# EAGLE board MicroBoardMk1 (EAGLE 7.2.0)
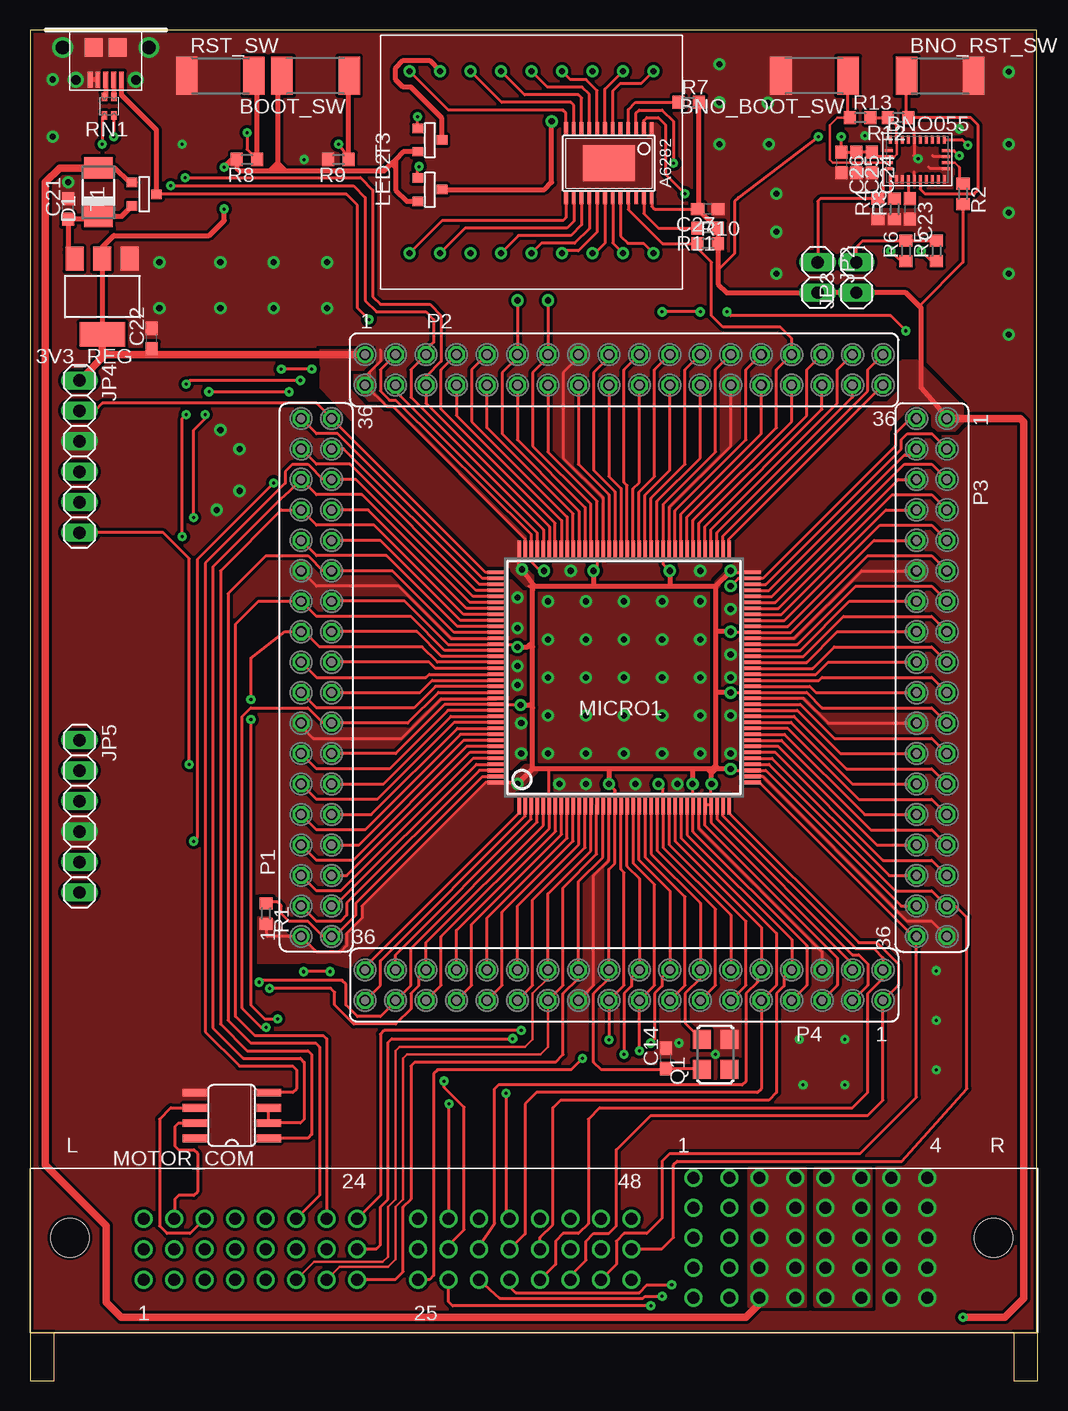
[diagram p4: board, top side]
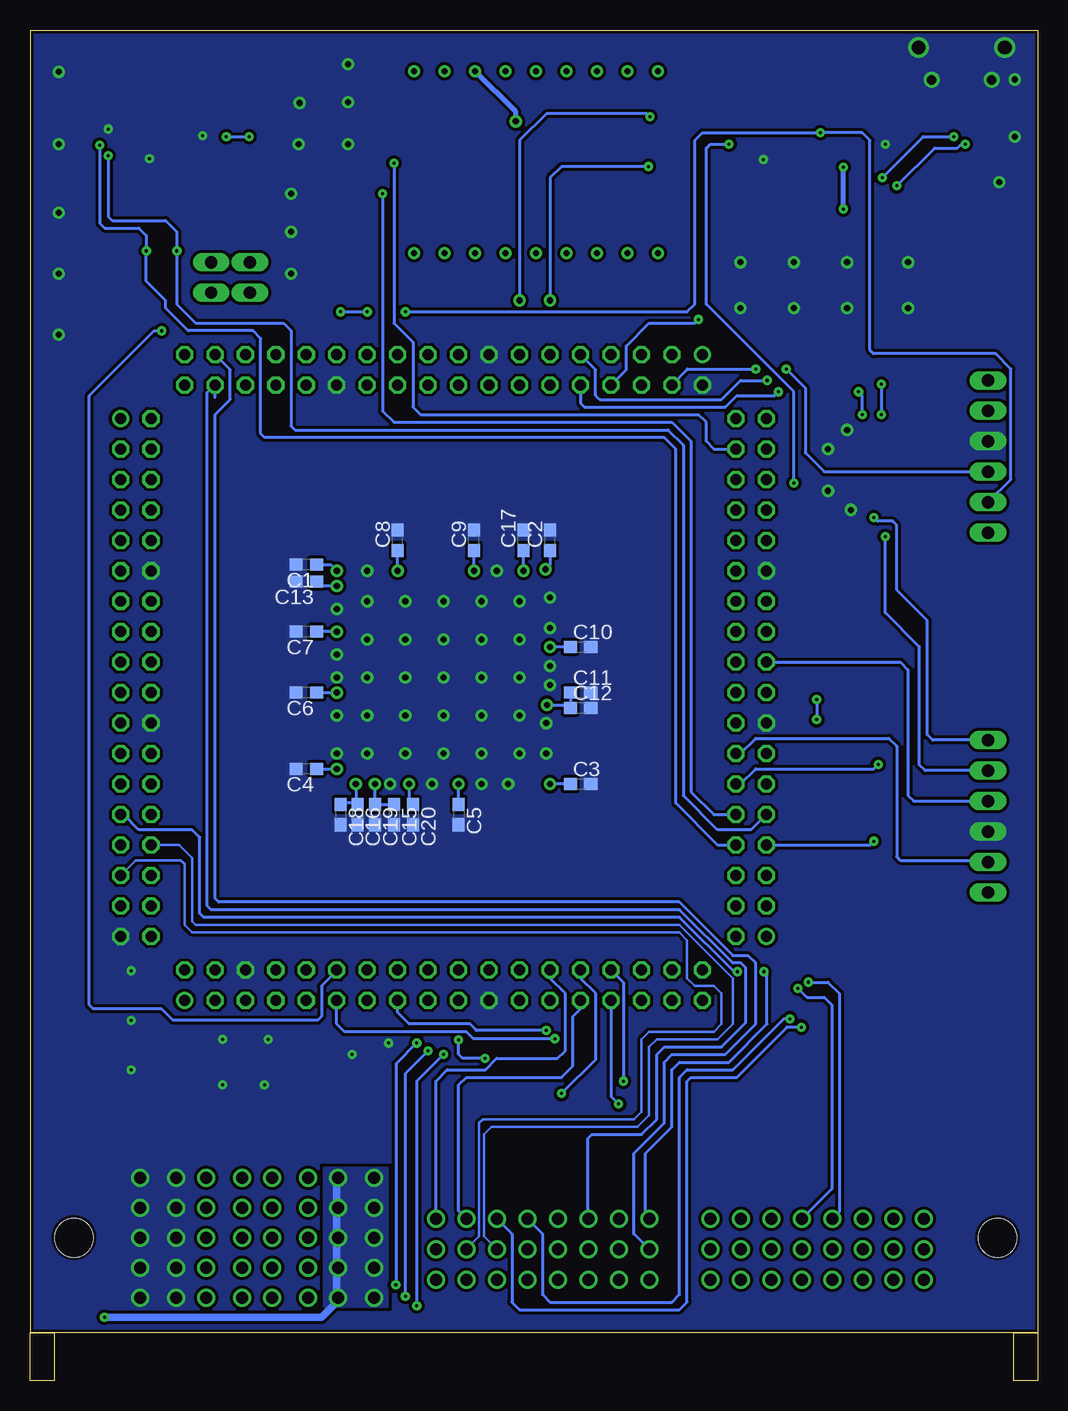
[diagram p5: board, bottom side, seen from below]

Size 83.95 x 108.58 mm. Coordinates in mm from the lower left corner, seen from the top.
Outline: 0,0 83.95,0 83.95,108.58 0,108.58 0,0
Copper layers (1*16): Top 0.035mm / dielectric 1.5mm / Bottom 0.035mm
Design rules "GoldPhoenix": minimum track width 7mil, minimum drill 10mil, track to track 7mil, track to pad 7mil, pad to pad 7mil, via to via 7mil, smd to smd 7mil, copper to edge 10mil, drill to drill 8mil, minimum pad ring 10mil, minimum via ring 10mil, stop-mask expansion 4mil, vias tented up to drill 25mil, thermal gap 10mil

## Footprints (pad centres in the part's own frame; a part is rotated, then mirrored left to right if it is on the bottom)
SOT223 = smd 1.499 x 2.007: 1 -2.261,-3.15; 2 0.025,-3.15; 3 2.311,-3.15 | smd 3.81 x 2.007: 4 0,3.15
TSSOP24 = smd 0.305 x 0.991: 1 -3.575,-2.918; 2 -2.925,-2.918; 3 -2.275,-2.918; 4 -1.625,-2.918; 5 -0.975,-2.918; 6 -0.325,-2.918; 7 0.325,-2.918; 8 0.975,-2.918; 9 1.625,-2.918; 10 2.275,-2.918; 11 2.925,-2.918; 12 3.575,-2.918; 13 3.575,2.918; 14 2.925,2.918; 15 2.275,2.918; 16 1.625,2.918; 17 0.975,2.918; 18 0.325,2.918; 19 -0.325,2.918; 20 -0.975,2.918; 21 -1.625,2.918; 22 -2.275,2.918; 23 -2.925,2.918; 24 -3.575,2.918 | smd 4.32 x 3: PAD 0,0
TEN60-S24-S24-P4-RA = drill 1: P1.1 55.32,12.9; P1.2 55.32,10.4; P1.3 55.32,7.9; P1.4 55.32,5.4; P1.5 55.32,2.9; P1.6 58.32,2.9; P1.7 58.32,5.4; P1.8 58.32,7.9; P1.9 58.32,10.4; P1.10 58.32,12.9; P2.1 60.82,12.9; P2.2 60.82,10.4; P2.3 60.82,7.9; P2.4 60.82,5.4; P2.5 60.82,2.9; P2.6 63.82,2.9; P2.7 63.82,5.4; P2.8 63.82,7.9; P2.9 63.82,10.4; P2.10 63.82,12.9; P3.1 66.32,12.9; P3.2 66.32,10.4; P3.3 66.32,7.9; P3.4 66.32,5.4; P3.5 66.32,2.9; P3.6 69.32,2.9; P3.7 69.32,5.4; P3.8 69.32,7.9; P3.9 69.32,10.4; P3.10 69.32,12.9; P4.1 71.82,12.9; P4.2 71.82,10.4; P4.3 71.82,7.9; P4.4 71.82,5.4; P4.5 71.82,2.9; P4.6 74.82,2.9; P4.7 74.82,5.4; P4.8 74.82,7.9; P4.9 74.82,10.4; P4.10 74.82,12.9; S1 9.49,4.4; S2 12.03,4.4; S3 14.57,4.4; S4 17.11,4.4; S5 19.65,4.4; S6 22.19,4.4; S7 24.73,4.4; S8 27.27,4.4; S9 9.49,6.94; S10 12.03,6.94; S11 14.57,6.94; S12 17.11,6.94; S13 19.65,6.94; S14 22.19,6.94; S15 24.73,6.94; S16 27.27,6.94; S17 9.49,9.48; S18 12.03,9.48; S19 14.57,9.48; S20 17.11,9.48; S21 19.65,9.48; S22 22.19,9.48; S23 24.73,9.48; S24 27.27,9.48; S25 32.37,4.4; S26 34.91,4.4; S27 37.45,4.4; S28 39.99,4.4; S29 42.53,4.4; S30 45.07,4.4; S31 47.61,4.4; S32 50.15,4.4; S33 32.37,6.94; S34 34.91,6.94; S35 37.45,6.94; S36 39.99,6.94; S37 42.53,6.94; S38 45.07,6.94; S39 47.61,6.94; S40 50.15,6.94; S41 32.37,9.48; S42 34.91,9.48; S43 37.45,9.48; S44 39.99,9.48; S45 42.53,9.48; S46 45.07,9.48; S47 47.61,9.48; S48 50.15,9.48 | hole 3.2: 3.32,7.9; 80.32,7.9
LGA28 = smd 0.25 x 0.675: P$1 -2.25,1.663; P$6 -2.25,-1.663; P$7 -1.75,-1.663; P$8 -1.25,-1.663; P$9 -0.75,-1.663; P$10 -0.25,-1.663; P$11 0.25,-1.663; P$12 0.75,-1.663; P$13 1.25,-1.663; P$14 1.75,-1.663; P$15 2.25,-1.663; P$20 2.25,1.663; P$21 1.75,1.663; P$22 1.25,1.663; P$23 0.75,1.663; P$24 0.25,1.663; P$25 -0.25,1.663; P$26 -0.75,1.663; P$27 -1.25,1.663; P$28 -1.75,1.663 | smd 0.675 x 0.25: P$2 -2.362,0.75; P$3 -2.362,0.25; P$4 -2.362,-0.25; P$5 -2.362,-0.75; P$16 2.362,-0.75; P$17 2.362,-0.25; P$18 2.362,0.25; P$19 2.362,0.75
SW_2512 = smd 1.8 x 3.2: 1 -2.8,0; 2 2.8,0
C0603 = smd 1.1 x 1: 1 -0.85,0; 2 0.85,0
DO-214AC = smd 1.8 x 2.4: A 2.025,0; C -2.025,0
MICRO_B = smd 1.5 x 1.55: GND1 -1,1.45; GND2 1,1.45 | drill 0.8: GND3 -2.5,4.15; GND4 2.5,4.15 | drill 1.15: GND7 -3.598,1.45; GND8 3.598,1.45 | smd 0.4 x 1.35: P1 -1.3,4.15; P2 -0.65,4.15; P3 0,4.15; P4 0.65,4.15; P5 1.3,4.15
1X02 = drill 1.016 long: 1 -1.27,0; 2 1.27,0
1X06 = drill 1.016 long: 1 -6.35,0; 2 -3.81,0; 3 -1.27,0; 4 1.27,0; 5 3.81,0; 6 6.35,0
SOT-23 = smd 0.787 x 0.889: 1 0.025,-1.016; 2 -0.94,1.016; 3 0.991,1.016
SQFP-S-20X20-144 = smd 0.3 x 1.6: 1 -8.75,-10.6; 2 -8.25,-10.6; 3 -7.75,-10.6; 4 -7.25,-10.6; 5 -6.75,-10.6; 6 -6.25,-10.6; 7 -5.75,-10.6; 8 -5.25,-10.6; 9 -4.75,-10.6; 10 -4.25,-10.6; 11 -3.75,-10.6; 12 -3.25,-10.6; 13 -2.75,-10.6; 14 -2.25,-10.6; 15 -1.75,-10.6; 16 -1.25,-10.6; 17 -0.75,-10.6; 18 -0.25,-10.6; 19 0.25,-10.6; 20 0.75,-10.6; 21 1.25,-10.6; 22 1.75,-10.6; 23 2.25,-10.6; 24 2.75,-10.6; 25 3.25,-10.6; 26 3.75,-10.6; 27 4.25,-10.6; 28 4.75,-10.6; 29 5.25,-10.6; 30 5.75,-10.6; 31 6.25,-10.6; 32 6.75,-10.6; 33 7.25,-10.6; 34 7.75,-10.6; 35 8.25,-10.6; 36 8.75,-10.6; 73 8.75,10.6; 74 8.25,10.6; 75 7.75,10.6; 76 7.25,10.6; 77 6.75,10.6; 78 6.25,10.6; 79 5.75,10.6; 80 5.25,10.6; 81 4.75,10.6; 82 4.25,10.6; 83 3.75,10.6; 84 3.25,10.6; 85 2.75,10.6; 86 2.25,10.6; 87 1.75,10.6; 88 1.25,10.6; 89 0.75,10.6; 90 0.25,10.6; 91 -0.25,10.6; 92 -0.75,10.6; 93 -1.25,10.6; 94 -1.75,10.6; 95 -2.25,10.6; 96 -2.75,10.6; 97 -3.25,10.6; 98 -3.75,10.6; 99 -4.25,10.6; 100 -4.75,10.6; 101 -5.25,10.6; 102 -5.75,10.6; 103 -6.25,10.6; 104 -6.75,10.6; 105 -7.25,10.6; 106 -7.75,10.6; 107 -8.25,10.6; 108 -8.75,10.6 | smd 1.6 x 0.3: 37 10.6,-8.75; 38 10.6,-8.25; 39 10.6,-7.75; 40 10.6,-7.25; 41 10.6,-6.75; 42 10.6,-6.25; 43 10.6,-5.75; 44 10.6,-5.25; 45 10.6,-4.75; 46 10.6,-4.25; 47 10.6,-3.75; 48 10.6,-3.25; 49 10.6,-2.75; 50 10.6,-2.25; 51 10.6,-1.75; 52 10.6,-1.25; 53 10.6,-0.75; 54 10.6,-0.25; 55 10.6,0.25; 56 10.6,0.75; 57 10.6,1.25; 58 10.6,1.75; 59 10.6,2.25; 60 10.6,2.75; 61 10.6,3.25; 62 10.6,3.75; 63 10.6,4.25; 64 10.6,4.75; 65 10.6,5.25; 66 10.6,5.75; 67 10.6,6.25; 68 10.6,6.75; 69 10.6,7.25; 70 10.6,7.75; 71 10.6,8.25; 72 10.6,8.75; 109 -10.6,8.75; 110 -10.6,8.25; 111 -10.6,7.75; 112 -10.6,7.25; 113 -10.6,6.75; 114 -10.6,6.25; 115 -10.6,5.75; 116 -10.6,5.25; 117 -10.6,4.75; 118 -10.6,4.25; 119 -10.6,3.75; 120 -10.6,3.25; 121 -10.6,2.75; 122 -10.6,2.25; 123 -10.6,1.75; 124 -10.6,1.25; 125 -10.6,0.75; 126 -10.6,0.25; 127 -10.6,-0.25; 128 -10.6,-0.75; 129 -10.6,-1.25; 130 -10.6,-1.75; 131 -10.6,-2.25; 132 -10.6,-2.75; 133 -10.6,-3.25; 134 -10.6,-3.75; 135 -10.6,-4.25; 136 -10.6,-4.75; 137 -10.6,-5.25; 138 -10.6,-5.75; 139 -10.6,-6.25; 140 -10.6,-6.75; 141 -10.6,-7.25; 142 -10.6,-7.75; 143 -10.6,-8.25; 144 -10.6,-8.75
SO08 = smd 0.66 x 2.032: 1 -1.905,-3.073; 2 -0.635,-3.073; 3 0.635,-3.073; 4 1.905,-3.073; 5 1.905,3.073; 6 0.635,3.073; 7 -0.635,3.073; 8 -1.905,3.073
FE18-2 = drill 0.914: 1 -21.59,1.27 | drill 0.914 octagon: 2 -21.59,-1.27; 3 -19.05,1.27; 4 -19.05,-1.27; 5 -16.51,1.27; 6 -16.51,-1.27; 7 -13.97,1.27; 8 -13.97,-1.27; 9 -11.43,1.27; 10 -11.43,-1.27; 11 -8.89,1.27; 12 -8.89,-1.27; 13 -6.35,1.27; 14 -6.35,-1.27; 15 -3.81,1.27; 16 -3.81,-1.27; 17 -1.27,1.27; 18 -1.27,-1.27; 19 1.27,1.27; 20 1.27,-1.27; 21 3.81,1.27; 22 3.81,-1.27; 23 6.35,1.27; 24 6.35,-1.27; 25 8.89,1.27; 26 8.89,-1.27; 27 11.43,1.27; 28 11.43,-1.27; 29 13.97,1.27; 30 13.97,-1.27; 31 16.51,1.27; 32 16.51,-1.27; 33 19.05,1.27; 34 19.05,-1.27; 35 21.59,1.27; 36 21.59,-1.27
ASF = smd 1.6 x 1.5: 1 -1.25,-1.15; 2 1.25,-1.15; 3 1.25,1.15; 4 -1.25,1.15
R0603 = smd 1 x 1.1: 1 -0.85,0; 2 0.85,0
EXBV4V = smd 0.45 x 0.7: 1 -0.4,-0.775; 2 0.4,-0.775; 3 0.4,0.775; 4 -0.4,0.775
LEDDISP = drill 0.5: P$1 2.44,2.995; P$2 4.98,2.995; P$3 7.52,2.995; P$4 10.06,2.995; P$5 12.6,2.995; P$6 15.14,2.995; P$7 17.68,2.995; P$8 20.22,2.995; P$9 22.76,2.995; P$10 2.44,18.155; P$11 4.98,18.155; P$12 7.52,18.155; P$13 10.06,18.155; P$14 12.6,18.155; P$15 15.14,18.155; P$16 17.68,18.155; P$17 20.22,18.155; P$18 22.76,18.155

## Placement (x,y rotation side)
3V3_REG  AP1117-3.3SOT223  [SOT223]  6.03,86.36 180 top
A6282  A6282  [TSSOP24]  48.26,97.47 180 top
BACKPLANECON_  TEN60-S24-S24-P4-RA  [TEN60-S24-S24-P4-RA]  0,0 0 top
BNO055  BNO055  [LGA28]  73.98,97.79 0 top
BNO_BOOT_SW  SWITCH  [SW_2512]  65.41,104.78 180 top
BNO_RST_SW  SWITCH  [SW_2512]  75.88,104.78 0 top
BOOT_SW  SWITCH  [SW_2512]  23.81,104.78 180 top
C1  0.1uF  [C0603]  60.96,64.01 180 bottom
C2  0.1uF  [C0603]  40.64,66.04 90 bottom
C3  0.1uF  [C0603]  38.1,45.72 0 bottom
C4  0.1uF  [C0603]  60.96,46.99 180 bottom
C5  0.1uF  [C0603]  48.26,43.18 270 bottom
C6  0.1uF  [C0603]  60.96,53.34 180 bottom
C7  0.1uF  [C0603]  60.96,58.42 180 bottom
C8  0.1uF  [C0603]  53.34,66.04 90 bottom
C9  0.1uF  [C0603]  46.99,66.04 90 bottom
C10  0.1uF  [C0603]  38.1,57.15 0 bottom
C11  0.1uF  [C0603]  38.1,53.34 0 bottom
C12  4.7uF  [C0603]  38.1,52.07 0 bottom
C13  2.2uF  [C0603]  60.96,62.61 180 bottom
C14  0.01uF  [C0603]  53.02,22.86 90 top
C15  1uF  [C0603]  53.66,43.18 270 bottom
C16  10nF  [C0603]  56.71,43.18 270 bottom
C17  2.2uF  [C0603]  42.86,66.04 90 bottom
C18  1uF  [C0603]  58.1,43.18 270 bottom
C19  10nF  [C0603]  55.24,43.18 270 bottom
C20  0.1uF  [C0603]  52.07,43.18 270 bottom
C21  0.22uF  [C0603]  3.17,93.66 90 top
C22  0.22uF  [C0603]  10.16,82.87 90 top
C23  0.1uF  [C0603]  73.34,93.66 270 top
C24  0.1uF  [C0603]  70.17,97.55 270 top
C25  6.8nF  [C0603]  68.9,97.55 270 top
C26  120nF  [C0603]  67.63,97.55 270 top
C27  0.1uF  [C0603]  56.52,93.66 180 top
D1  S1M-E3/61T  [DO-214AC]  5.71,95.06 90 top
JP1  MICROUSB  [MICRO_B]  6.32,108.58 180 top
JP2  [1X02]  65.67,87.95 270 top
JP3  [1X02]  68.9,87.95 90 top
JP4  [1X06]  4.13,73.03 270 top
JP5  [1X06]  4.13,43.03 270 top
LED2  FDN340P  [SOT-23]  33.34,95.25 90 top
MICRO1  [SQFP-S-20X20-144]  49.53,54.61 0 top
MOTOR_COM  MAX481CSA  [SO08]  16.83,18.1 90 top
P1  [FE18-2]  23.88,54.61 90 top
P2  [FE18-2]  49.53,80.26 0 top
P3  [FE18-2]  75.18,54.61 270 top
P4  [FE18-2]  49.53,28.96 180 top
Q1  ASV-8  [ASF]  57.15,23.18 90 top
R1  0 Ohm  [R0603]  19.68,34.92 270 top
R2  4.7K  [R0603]  77.79,94.93 270 top
R3  4.7K  [R0603]  72.07,93.66 90 top
R4  4.7K  [R0603]  70.68,93.66 90 top
R5  4.7K  [R0603]  75.56,90.17 90 top
R6  4.7K  [R0603]  73.03,90.17 90 top
R7  10K  [R0603]  54.93,102.55 0 top
R8  10K  [R0603]  18.1,97.79 180 top
R9  [R0603]  25.72,97.79 180 top
R10  [R0603]  56.52,90.78 0 top
R11  820  [R0603]  56.52,92.08 180 top
R12  4.7K  [R0603]  72.39,101.28 180 top
R13  4.7K  [R0603]  69.22,101.28 0 top
RN1  [EXBV4V]  6.6,102.23 180 top
RST_SW  SWITCH  [SW_2512]  15.88,104.78 0 top
T1  FDN340P  [SOT-23]  9.53,94.87 90 top
T3  FDN340P  [SOT-23]  33.34,99.38 90 top
U$3  LEDDISP  [LEDDISP]  29.21,87 0 top

## Tracks (layer width: path | path; a pad name or v marks a point on that pad's centre or on a via)
!OE_LED
  Top 0.254: A6282.21 49.88,93.62 52.73,90.78 R10.1 55.66,90.39 56.83,89.22 56.83,84.77 57.78,83.82 62.55,83.82 63.5,82.87 P2.29 62.23,80.26 62.23,75.44 54.78,67.99 MICRO1.80
+3V3  (via drill 0.25, 0.51)
  Top 0.203: BNO055.P$3 72.07,98.04 72.25,98.22 72.25,99.35 72.25,99.43 BNO055.P$28 72.23,100.59 R12.2
  Top 0.254: P2.25 57.15,80.26 57.15,73.41 52.78,69.04 MICRO1.84 52.78,64.06 v53.34,63.5 | P2.14 43.18,73.41 47.28,69.31 MICRO1.95 47.28,63.79 v46.99,63.5 | P1.24 31.24,60.96 34.84,57.36 MICRO1.121 40.43,57.36 v40.64,57.15 | P1.14 30.48,48.26 34.58,52.36 MICRO1.131 40.86,52.36 v40.89,52.32 | P4.31 34.29,28.96 34.29,33.02 43.31,42.04 43.31,43.98 MICRO1.6 43.28,46.89 43.18,46.99 | P4.7 64.77,28.96 64.77,32.26 55.28,41.75 MICRO1.30 55.24,44.05 v55.24,45.72 | P4.5 67.31,28.96 67.31,31.24 56.28,42.27 MICRO1.32 MICRO1.33 | MICRO1.33 56.78,42.53 68.58,30.73 P4.4 | P3.34 72.64,35.56 61.34,46.86 MICRO1.39 58.55,46.86 v58.42,46.99 | P3.21 75.18,52.07 66.04,52.07 64.75,53.36 MICRO1.52 C6.1 v58.42,53.34 | P3.11 75.18,64.77 69.85,64.77 63.44,58.36 MICRO1.62 58.48,58.36 v58.42,58.42 | 55.24,46.86 55.37,46.99 | 57.15,53.34 57.17,53.36 57.19,53.34 | 41.66,52.32 41.91,52.07 | 41.7,57.36 41.91,57.15 | v40.64,45.72 40.5,45.86 MICRO1.144 | MICRO1.144 37.99,45.86 27.69,35.56 27.69,34.54 26.42,33.27 26.42,32.26 25.91,31.75 23.88,31.75 P1.1 19.79,33.02 R1.2 | MICRO1.144 40.78,45.86 | v41.02,63.63 40.77,63.88 40.77,65.2 MICRO1.108 | v58.42,63.5 58.56,63.36 MICRO1.72 | MICRO1.33 56.78,45.67 v56.83,45.72 | 56.83,46.93 56.77,46.99 | 41.91,61.91 41.59,62.23 | 42.23,62.23 41.91,62.55 | MICRO1.17 48.78,45.2 v48.26,45.72 48.77,45.21 48.77,39.12 48.26,38.61 P4.20 48.26,29.53 46.99,28.26 46.99,22.54 47.62,21.91 52.92,21.91 C14.1 55.92,22.01 Q1.4 | A6282.24 51.84,93.9 52.07,93.66 C27.2 55.78,93.78 | R11.1 R10.2 | R13.2 R12.2 | R2.2 77.79,89.22 74.14,85.57 | BNO055.P$3 70.45,98.04 C24.1 C25.1 C26.1 v67.63,99.69
  Top 0.254: v65.72,99.69 59.05,94.61 58.74,94.3 58.74,89.95 57.37,88.58
  Top 0.406: 57.15,46.99 56.9,46.99 | 56.52,46.99 56.77,46.99 56.9,46.99 | 56.52,46.99 55.37,46.99 55.24,46.99 | 55.24,46.99 48.26,46.99 | 48.26,46.99 43.18,46.99 41.91,46.99 | 41.91,46.99 41.91,52.07 41.91,57.15 41.91,61.91 41.91,62.23 | 41.91,62.23 42.23,62.23 46.99,62.23 | 46.99,62.23 53.34,62.23 | 53.34,62.23 57.15,62.23 | 57.15,62.23 57.15,58.42 | 57.15,58.42 57.15,53.34 57.15,47.24 | 57.15,47.24 57.15,46.99 | v40.89,52.32 41.66,52.32 | v40.64,57.15 41.49,57.15 41.7,57.36 | v46.99,63.5 46.99,62.23 | v53.34,63.5 53.34,62.23 | v58.42,58.42 57.15,58.42 | v58.42,53.34 57.19,53.34 | 48.26,46.99 v48.26,45.72 | v58.42,46.99 57.4,46.99 | 57.4,46.99 57.15,46.99 | 40.78,45.86 41.91,46.99 | 41.91,62.23 41.91,62.42 v41.02,63.63 | 57.15,62.23 v58.42,63.5 | v56.83,45.72 56.83,46.93 | 55.24,46.99 v55.24,45.72 | 56.52,46.99 56.77,46.74 56.9,46.74 57.15,46.99 | 57.4,46.99 57.15,47.24 | 56.9,46.99 57.15,47.24 | BOOT_SW.2 20.64,104.4 20.64,97.47 | v16.19,93.66 16.19,92.71 14.92,91.44 6.99,91.44 6.01,90.46 3V3_REG.2 6.01,83.24 3V3_REG.4 | 31.11,98.42 32.32,98.49 T3.2 31.13,98.44 31.11,98.42 | 31.11,98.42 30.48,97.79 | 30.48,97.79 30.48,97.16 | 30.48,97.16 30.48,95.25 31.43,94.3 32.31,94.3 LED2.2 | 76.52,76.2 74.3,78.74 74.3,85.41 74.14,85.57 73.03,86.68 JP3.1 JP2.2 58.1,86.68 57.37,87.42 57.37,88.58 R11.1 57.15,92.08 57.15,92.18 C27.2 | 55.78,93.78 R7.2 | 20,96.84 17.46,96.84 17.25,97.05 R8.2 16.83,97.79 v16.19,97.16 | 20,96.84 20.64,96.84 | 20.64,96.84 21.27,96.84 | 21.27,96.84 29.53,96.84 30.16,97.47 | 20.64,97.47 20.64,96.84 | 20,96.84 20.64,97.47 | 20.64,97.47 21.27,96.84 | 30.16,97.47 30.48,97.79 | 30.16,97.47 30.48,97.16
  Top 0.61: v77.79,1.27 81.28,1.27 82.87,2.86 82.87,75.88 82.55,76.2 76.52,76.2 P3.1 | P2.1 9.84,81.53 | 9.84,81.53 6.41,81.53 6.35,81.6 | JP4.1 6.35,81.6 | 6.35,81.6 6.03,81.92 3V3_REG.4 | C22.1 9.84,81.7 9.84,81.53
  Bottom 0.254: 40.6,52.32 v40.89,52.32 39.2,52.32 C12.1 C11.1 | C10.1 v40.64,57.15 | v46.99,63.5 C9.1 | v53.34,63.5 C8.1 | v58.42,58.42 C7.1 | C6.1 v58.42,53.34 | C4.1 v58.42,46.99 | C3.1 v40.64,45.72 | C2.1 40.64,64.01 v41.02,63.63 | C1.1 58.93,64.01 v58.42,63.5 | C15.1 C19.1 v55.24,45.72 | v56.83,45.72 56.83,44.16 | 56.83,44.16 C16.1 | 56.83,44.16 57.98,44.16 C18.1 | C5.1 v48.26,45.72 | v67.63,99.69 v65.72,99.69 | P1.14 24.77,48.26 23.5,49.53 12.38,49.53 11.75,48.9 11.75,39.69 11.43,39.37 4.29,39.37 JP5.5
  Bottom 0.406: v16.19,93.66 v16.19,97.16
  Bottom 0.61: BACKPLANECON_.P1.10 58.42,12.8 58.42,2.54 59.69,1.27 v77.79,1.27
  pour Top (isolate 0.305, no thermals): 41.91,62.23 41.4,62.23 39.62,64.01 39.37,63.75 38.35,63.75 26.92,75.18 26.92,75.95 24.26,78.74 24.26,81.92 28.45,81.92 28.45,80.26 26.54,80.26 26.54,78.74 27.94,77.22 28.96,77.22 29.46,76.71 29.97,76.71 40.77,65.91 40.77,64.26 41.91,63.12
  pour Bottom (isolate 0.305, no thermals): 59.37,2.22 59.37,13.65 54.61,13.65 54.29,13.65 54.29,2.22
  pour Top (isolate 0.305, no thermals): 57.15,61.91 58.74,63.5 60.96,63.5 71.75,74.3 71.75,75.56 73.34,77.15 74.61,77.15 75.25,76.52 75.25,75.56 75.56,75.25 77.15,75.25 77.79,75.88 77.79,77.15 73.98,80.96 72.71,80.96 72.39,80.64 72.39,78.42 71.44,77.47 70.17,77.47 58.74,66.04 58.74,64.14 57.15,62.55
  pour Top (isolate 0.305, no thermals): 41.27,47.31 41.91,47.31 42.23,46.99 42.23,46.67 40.32,44.77 40.32,43.5 28.26,31.43 27.62,31.43 26.67,30.48 26.35,30.48 25.08,30.8 19.05,30.8 19.05,34.61 20,34.61 21.59,33.02 22.54,33.02 23.81,31.75 25.72,31.75 26.35,32.38 26.35,33.34 27.62,34.61 27.62,35.56 37.78,45.72 40.01,45.72 40.32,46.04 40.32,46.35
+5V
  Top 0.406: T1.3 8.8,95.89 8.26,95.89 7.06,97.08 D1.A
  Top 0.61: BACKPLANECON_.P2.5 60.82,2.4 59.69,1.27 7.62,1.27 6.35,2.54 6.35,8.89 1.27,13.97 1.27,95.89 2.47,97.08 D1.A 6.1,97.16
  pour Top (isolate 0.305, no thermals): 60.01,2.22 60.01,13.65 64.58,13.65 64.58,2.22
+12V
  pour Top (isolate 0.305, no thermals): 65.53,2.22 65.53,13.65 70.04,13.65 70.04,2.22
BILGEPWM  (via drill 0.25)
  Top 0.254: P3.27 75.18,44.45 69.09,44.45 63.18,50.36 MICRO1.46 | v25.01,30.09 v22.81,30.09
  Bottom 0.254: BACKPLANECON_.S41 32.7,9.81 32.7,14.92 30.48,17.14 30.48,21.91 29.84,22.54 25.72,22.54 22.54,25.72 22.54,29.82 v22.81,30.09 | P3.27 76.2,43.18 74.93,41.91 70.48,41.91 69.85,41.27 69.85,34.92 69.53,34.61 29.84,34.61 25.32,30.09 v25.01,30.09
BNO055_SCL  (via drill 0.25)
  Top 0.254: MICRO1.136 35.89,49.86 27.94,41.91 23.88,41.91 P1.9 | BNO055.P$19 77.04,98.54 v77.47,98.11 | 71.75,90.27 v71.75,90.17 72.39,89.53 72.81,89.53 R6.1
  Bottom 0.254: v77.47,98.11 77.47,93.03 77.15,92.71 72.71,92.71 71.75,91.76 v71.75,90.17 71.75,85.72 70.17,84.14 62.87,84.14 62.23,83.5 62.23,75.56 61.91,75.25 30.8,75.25 29.53,73.98 29.53,44.77 26.67,41.91 23.88,41.91 P1.9
BNO055_SDA  (via drill 0.25)
  Top 0.254: P1.8 27.43,40.64 36.15,49.36 MICRO1.137 | BNO055.P$20 77.71,99.45 v78.18,98.98 | v74.3,90.17 74.93,89.53 75.35,89.53 R5.1
  Bottom 0.254: P1.8 26.67,40.64 30.16,44.13 30.16,73.66 31.11,74.61 64.45,74.61 64.77,74.93 64.77,82.87 65.41,83.5 70.8,83.5 72.71,85.41 72.71,86.04 74.3,87.63 v74.3,90.17 74.3,91.44 74.93,92.08 77.79,92.08 78.18,92.47 v78.18,98.98
BOOT0  (via drill 0.25)
  Top 0.254: MICRO1.138 36.41,48.86 26.92,39.37 23.88,39.37 P1.7 | v13.65,40.96 13.97,41.27 13.97,64.48 v20.32,70.83 | 26.57,97.89 v25.72,99.06
  Top 0.406: 26.67,104.72 BOOT_SW.1 26.57,104.73 26.57,97.89 R9.1
  Bottom 0.254: P1.7 13.97,40.64 v13.65,40.96 | v20.32,70.83 20.32,78.42 27.62,85.72 27.62,98.74 27.3,99.06 v25.72,99.06
CLAWCURRENT
  Top 0.254: MICRO1.40 61.61,47.36 72.14,36.83 75.18,36.83 P3.33 77.15,35.56 78.11,34.61 78.11,20.32 72.71,14.29 53.98,14.29 53.66,13.97 53.66,7.94 52.7,6.99 50.2,6.99 BACKPLANECON_.S40
CLAWPWM1  (via drill 0.25)
  Top 0.254: MICRO1.19 49.78,38.87 50.8,37.85 P4.18 50.16,29.59 50.16,28.89 49.53,28.26 v49.53,23.18 | v51.75,2.22 35.24,2.22 34.91,2.56 BACKPLANECON_.S26
  Bottom 0.254: v51.75,2.22 51.75,20.95 v49.53,23.18
CLAWPWM2  (via drill 0.25)
  Top 0.254: v48.26,24.4 P4.19 49.53,28.96 49.53,38.35 49.28,38.61 MICRO1.18 | BACKPLANECON_.S25 33.29,4.4 33.66,4.76 33.66,21.59 33.97,21.91 45.11,21.91 v46.06,22.86
  Bottom 0.254: v46.06,22.86 47.94,22.86 48.26,23.18 v48.26,24.4
D+1
  Top 0.406: JP1.P3 6.32,103.13 RN1.2
D-1
  Top 0.406: RN1.1 7,104.4 JP1.P2
FUSEDETECTM  (via drill 0.25)
  Top 0.254: P4.15 54.61,28.96 54.61,36.32 51.31,39.62 51.31,43.98 MICRO1.22 | BACKPLANECON_.S24 29.21,11.42 29.21,24.87 29.53,25.18 v40.96,25.18
  Bottom 0.254: P4.15 53.34,26.67 52.39,25.72 47.31,25.72 46.77,25.18 v40.96,25.18
FUSEDETECTP  (via drill 0.25)
  Top 0.254: P4.11 59.69,28.96 59.69,34.29 53.28,40.7 MICRO1.26 | BACKPLANECON_.S16 27.32,6.99 28.89,6.99 29.21,7.3 29.21,10.48 29.84,11.11 29.84,24.18 30.16,24.5 v40.25,24.5
  Bottom 0.254: P4.11 58.42,25.72 57.78,25.08 47.62,25.08 47.04,24.5 v40.25,24.5
GND  (via drill 0.25, 0.51)
  Top 0.254: P2.26 58.42,73.91 53.28,68.77 MICRO1.83 | P2.2 29.72,77.22 30.23,77.22 41.27,66.17 MICRO1.107 | P2.15 45.72,81.28 44.45,80.01 44.45,72.9 47.75,69.6 47.75,65.24 MICRO1.94 | P1.25 23.88,62.23 30.73,62.23 35.1,57.86 MICRO1.120 | P1.15 22.61,50.55 23.62,49.53 30.99,49.53 34.29,52.83 38.9,52.83 MICRO1.130 | P4.21 46.99,28.96 46.99,38.1 48.26,39.37 48.26,43.99 MICRO1.16 | P4.6 66.04,31.75 55.78,42.01 MICRO1.31 | P3.35 75.18,34.29 73.15,34.29 61.09,46.35 MICRO1.38 | P3.22 66.55,50.8 64.49,52.86 MICRO1.51 | P3.12 69.34,63.5 63.7,57.86 MICRO1.61 | BNO055.P$10 73.73,96.77 | BNO055.P$18 75.31,98.04 75.25,98.11 | BNO055.P$16 75.05,97.04 74.93,97.16 | BNO055.P$25 73.73,98.17 73.66,98.11 | 73.74,99.31 73.74,100.05 | 29.21,81.92 29.21,80.96 28.26,80.01 28.26,79.38 27.94,79.06
  Top 0.406: JP1.P4 JP1.P5
  other vias: 40.64,61.28 40.64,58.74 40.64,55.56 40.64,53.98 40.96,50.8 40.96,48.26 43.18,60.96 43.18,57.78 43.18,54.61 43.18,51.44 43.18,48.26 46.35,48.26 46.35,51.44 46.35,54.61 46.35,57.78 46.35,60.96 49.53,60.96 49.53,57.78 49.53,54.61 49.53,51.44 49.53,48.26 52.7,48.26 55.88,48.26 55.88,51.44 52.7,51.44 55.88,54.61 52.7,54.61 52.7,57.78 55.88,57.78 55.88,60.96 52.7,60.96 44.13,45.72 46.35,45.72 50.48,45.72 53.98,45.72 58.42,48.26 58.42,51.44 58.42,54.61 58.42,56.52 58.42,60.33 55.88,63.5 45.09,63.5 1.91,104.46 1.91,99.69 54.1,24.13 57.15,23.18 64.14,24.45 67.94,24.45 67.94,20.64 64.45,20.64 75.56,30.16 75.56,26.04 75.56,21.91 22.86,97.79 12.7,99.06 74.04,97.85 77.47,100.33 69.6,99.76 10.79,89.22 10.79,85.41 15.88,85.41 15.88,89.22 20.32,89.22 20.32,85.41 24.77,85.41 24.77,89.22 3.17,95.89 62.23,88.27 62.23,91.76 62.23,94.93 57.47,99.06 61.59,99.06 57.47,102.55 61.52,102.5 57.47,105.73 81.6,105.09 81.6,99.06 81.6,93.34 81.6,88.27 81.6,83.19 15.88,75.25 17.46,73.66 15.56,68.58 17.46,70.17
  pour Top (isolate 0.254, rank 6, no thermals): 0,108.58 83.95,108.58 83.95,0 0,0
  pour Bottom (isolate 0.254, rank 6, no thermals): 0,0 83.95,0 83.95,108.58 0,108.58
LASER_RX
  Top 0.254: MICRO1.119 35.37,58.36 30.23,63.5 P1.26 24.45,63.5 23.18,64.77 19.68,64.77 16.51,61.59 16.51,26.04 18.41,24.13 23.81,24.13 24.13,23.81 24.13,11.42 BACKPLANECON_.S22
LASER_TX
  Top 0.254: MICRO1.122 34.58,56.86 31.75,59.69 23.88,59.69 P1.23 19.05,60.96 17.14,59.05 17.14,26.35 18.73,24.77 24.45,24.77 24.73,24.48 BACKPLANECON_.S23 24.77,9.53 24.77,9.52
LED1  (via drill 0.25, 0.51)
  Top 0.254: MICRO1.98 45.77,65.17 45.77,68.48 39.37,74.93 39.37,80.01 40.64,81.28 P2.11 v40.64,86.04 | LED2.3 32.32,97.09 v32.44,97.21
  Bottom 0.254: v32.44,97.21 39.69,97.21 40.64,96.25 v40.64,86.04
LED1_
  Top 0.254: MICRO1.102 43.78,67.47 34.29,76.96 34.29,80.26 P2.7
LED2  (via drill 0.25, 0.51)
  Top 0.254: MICRO1.96 46.74,65.25 46.74,69.09 41.91,73.91 41.91,80.01 43.18,81.28 P2.13 v43.18,86.04 | T3.3 v32.32,101.35
  Bottom 0.254: v32.32,101.35 32.58,101.6 40.96,101.6 43.18,99.38 v43.18,86.04
LEDA
  Top 0.254: A6282.11 45.34,102.3 45.09,102.55 39.33,102.55 U$3.P$12
LEDB
  Top 0.254: A6282.12 44.69,101.68 44.45,101.92 34.88,101.92 U$3.P$10
LEDC
  Top 0.254: A6282.20 49.23,91.42 49.85,90.81 51.16,90.81 U$3.P$9
LEDD
  Top 0.254: A6282.18 47.94,90.8 47.31,90.17 47.07,90.17 U$3.P$7
LEDDP
  Top 0.254: A6282.19 48.59,90.83 U$3.P$8
LEDE
  Top 0.254: A6282.13 44.69,92.94 44.45,92.71 34.37,92.71 U$3.P$1
LEDF
  Top 0.254: A6282.6 48.59,103.51 49.21,104.14 50.96,104.14 U$3.P$18
LEDG
  Top 0.254: A6282.8 47.28,103.53 46.35,104.46 45.04,104.46 U$3.P$15
LEDH
  Top 0.254: A6282.9 46.63,103.22 46.04,103.82 43.14,103.82 U$3.P$14
LEDJ
  Top 0.254: A6282.17 47.28,91.73 45.72,90.17 44.53,90.17 U$3.P$6
LEDK
  Top 0.254: A6282.16 46.63,92.04 45.4,90.81 42.62,90.81 U$3.P$5
LEDL
  Top 0.254: A6282.15 45.98,92.34 45.09,91.44 40.72,91.44 U$3.P$4
LEDM
  Top 0.254: A6282.14 45.34,92.64 44.77,92.08 36.27,92.08 U$3.P$2
LEDN
  Top 0.254: A6282.10 45.98,102.92 45.72,103.19 41.23,103.19 U$3.P$13
LEDP
  Top 0.254: A6282.7 47.94,103.66 U$3.P$17
LEDPWM1  (via drill 0.25, 0.25 pad 0.3)
  Top 0.254: BACKPLANECON_.S27 39.15,2.86 51.12,2.86 51.28,3.02 v52.7,3.02 | v50.8,23.5 P4.17 52.07,28.96 52.07,37.34 50.29,39.12 50.29,44 MICRO1.20
  Bottom 0.254: v52.7,3.02 52.7,21.59 v50.8,23.5
LEDPWM2  (via drill 0.25)
  Top 0.254: MICRO1.21 50.78,39.39 53.34,36.83 P4.16 52.7,29.59 52.7,28.89 52.07,28.26 52.07,24.45 v51.75,24.13 | BACKPLANECON_.S28 39.99,3.83 40.48,3.33 50.8,3.33 51.44,3.97 v53.5,3.97
  Bottom 0.254: v53.5,3.97 53.5,22.38 v51.75,24.13
LEDPWM3
  Top 0.254: MICRO1.35 57.78,43.06 68.83,32 70.36,32 71.12,31.24 P4.2 71.12,29.53 69.85,28.26 69.85,20 68.58,18.73 47.5,18.73 46.55,17.78 46.55,9.08 45.72,8.26 44.45,8.26 43.81,7.62 43.81,5.68 BACKPLANECON_.S29
LEDPWM4
  Top 0.254: MICRO1.36 58.28,43.32 69.09,32.51 70.61,32.51 72.39,30.73 72.39,28.96 P4.1 71.12,19.37 69.85,18.1 51.75,18.1 48.9,15.24 48.9,8.89 48.26,8.26 46.99,8.26 46.35,7.62 46.35,6.03 45.07,4.75 BACKPLANECON_.S30
LEDPWM5
  Top 0.254: MICRO1.37 60.82,45.86 73.41,33.27 73.66,33.27 P3.36 73.91,19.62 69.22,14.92 53.34,14.92 52.7,14.29 52.7,9.53 51.44,8.26 49.53,8.26 48.9,7.62 48.9,5.68 BACKPLANECON_.S31
MCOM+
  Top 0.254: BACKPLANECON_.S19 13.35,8.26 11.43,8.26 10.79,8.89 10.79,17.78 11.75,18.73 MOTOR_COM.6
MCOM-
  Top 0.254: BACKPLANECON_.S18 12.06,9.52 12.06,11.11 12.38,11.43 13.65,11.43 13.97,11.75 13.97,14.92 13.65,15.24 12.38,15.24 12.06,15.56 12.06,17.14 12.38,17.46 MOTOR_COM.7
MOTOR_EN
  Top 0.254: MICRO1.114 36.68,60.86 27.69,69.85 23.88,69.85 P1.31 21.65,70.17 20.95,69.53 15.24,63.82 15.24,25.4 17.78,22.86 22.54,22.86 22.86,22.54 22.86,17.78 22.54,17.46 MOTOR_COM.2 MOTOR_COM.3
MOTOR_RX
  Top 0.254: MICRO1.116 36.15,59.86 28.7,67.31 23.88,67.31 P1.29 20.95,68.58 15.88,63.5 15.88,25.72 18.1,23.5 23.18,23.5 23.5,23.18 23.5,16.51 23.18,16.19 MOTOR_COM.1
MOTOR_TX
  Top 0.254: MICRO1.113 36.94,61.36 27.18,71.12 P1.32 24.45,71.12 23.18,72.39 21.91,72.39 21.27,71.75 21.27,70.8 14.61,64.14 14.61,25.08 17.46,22.23 21.91,22.23 22.23,21.91 22.23,20.32 21.91,20 MOTOR_COM.4
N$10
  Top 0.254: BNO055.P$9 73.23,94.63 C23.1
N$11
  Top 0.203: BNO055.P$17 77.08,97.54 77.47,97.16
  Top 0.254: 77.47,97.16 77.47,96.1 R2.1
N$12
  Top 0.254: BNO055.P$5 71.32,97.04 71.12,96.84 71.12,94.96 R4.2 65.89,94.51 65.67,94.3 JP2.1
N$20
  Top 0.254: BNO055.P$6 71.73,94.86 R3.2
N$22
  Top 0.254: JP3.2 68.9,90.49 69.43,91.02 R6.2 R5.2
N$23
  Top 0.406: T3.1 34.35,101.22 31.75,103.82 31.11,103.82 30.48,104.46 30.48,105.41 31.11,106.05 33.3,106.05 U$3.P$11
N$26
  Top 0.203: BNO055.P$4 66.92,97.54 66.67,97.79 66.67,100.65 67.31,101.28 R13.1
  Top 0.254: R13.1 68.2,101.44 BNO_BOOT_SW.1
N$27
  Top 0.254: BNO055.P$11 74.23,95.32 74.61,94.93 78.74,94.93 79.06,95.25 79.06,100.65 78.42,101.28 R12.1 73.08,101.44 BNO_RST_SW.1
N$48  (via drill 0.51)
  Top 0.406: LED2.1 42.89,95.28 43.5,95.89 v43.5,100.97
  Bottom 0.406: v43.5,100.97 43.5,101.76 U$3.P$16
N$52
  Top 0.254: A6282.4 49.88,101.95 50.48,102.55 R7.1
N$55
  Top 0.254: A6282.23 51.19,93.28 52.39,92.08 R11.2
NRST  (via drill 0.25, 0.51)
  Top 0.254: P4.12 58.42,34.8 52.78,40.44 MICRO1.25 52.78,45.33 v52.39,45.72 | v73.03,83.5 71.75,84.77 58.42,84.77 v58.1,85.09 | v55.88,85.09 v52.7,85.09 | v18.1,100.01 18.1,98.64 R8.1
  Top 0.406: 18.73,104.72 RST_SW.2 18.95,104.5 R8.1
  Bottom 0.254: v52.39,45.72 52.39,44.35 C20.1 | P4.12 58.42,30.16 59.69,28.89 59.69,26.35 60.01,26.04 72.07,26.04 73.03,26.99 78.74,26.99 79.06,27.3 79.06,78.11 73.66,83.5 v73.03,83.5 | v58.1,85.09 v55.88,85.09 | v52.7,85.09 29.21,85.09 28.57,85.72 28.57,99.38 27.94,100.01 v18.1,100.01 14.61,100.01 13.97,99.38 13.97,81.92 13.65,81.6 3.49,81.6 2.22,80.33 2.22,71.12 JP4.5
OLED_RST
  Top 0.254: P1.19 23.88,54.61 33.02,54.61 33.27,54.86 MICRO1.126
  Bottom 0.254: P1.19 11.43,55.88 10.79,55.24 10.79,44.77 10.32,44.3 JP5.3
OLED_SCL  (via drill 0.25)
  Top 0.254: P2.9 36.83,80.26 36.83,75.95 44.78,68 MICRO1.100 | MICRO1.100 | v12.7,66.36 12.7,76.2 v13.02,76.52 | v22.54,79.38 13.34,79.38 v13.02,79.06
  Bottom 0.254: P2.9 36.84,80.27 36.84,78.11 36.51,77.79 26.35,77.79 24.77,79.38 v22.54,79.38 | v12.7,66.36 12.7,60.01 9.84,57.15 9.84,47.31 9.37,46.84 JP5.2 | v13.02,79.06 v13.02,76.52
OLED_SDA  (via drill 0.25)
  Top 0.254: MICRO1.99 45.28,68.26 38.1,75.44 P2.10 | v13.65,67.94 13.65,75.25 14.61,76.2 v14.61,76.52 | v14.92,78.42 v21.59,78.42
  Bottom 0.254: P2.10 38.1,77.47 37.78,77.15 26.04,77.15 25.08,78.11 21.91,78.11 v21.59,78.42 | v13.65,67.94 13.34,67.63 12.06,67.63 11.75,67.31 11.75,61.91 9.21,59.37 9.21,49.85 8.74,49.38 JP5.1 | v14.61,76.52 14.61,78.11 v14.92,78.42
PA0-WKUP
  Top 0.254: MICRO1.34 57.28,42.8 68.58,31.5 69.09,31.5 69.85,30.73 69.85,28.96 P4.3
PA5
  Top 0.254: MICRO1.41 61.87,47.86 71.63,38.1 P3.32
PA15
  Top 0.254: MICRO1.110 37.72,62.86 25.65,74.93 23.88,74.93 P1.35
PB1
  Top 0.254: MICRO1.47 63.44,50.86 68.58,45.72 P3.26
PB2
  Top 0.254: MICRO1.48 63.7,51.36 68.07,46.99 75.18,46.99 P3.25
PB4
  Top 0.254: MICRO1.134 35.37,50.86 28.96,44.45 23.88,44.45 P1.11
PB8
  Top 0.254: P1.6 26.42,38.1 36.7,48.39 38.9,48.39 MICRO1.139
PB9
  Top 0.254: MICRO1.140 36.94,47.86 25.91,36.83 23.88,36.83 P1.5
PB10
  Top 0.254: MICRO1.69 61.61,61.86 72.9,73.15 73.41,73.15 P3.4
PB11
  Top 0.254: P3.3 75.18,74.93 73.15,74.93 72.64,74.42 72.64,73.66 61.34,62.36 MICRO1.70
PB12
  Top 0.254: MICRO1.73 58.28,66.15 P2.36
PB13
  Top 0.254: MICRO1.74 57.78,66.42 69.85,78.49 69.85,80.26 P2.35
PC4
  Top 0.254: MICRO1.44 62.65,49.36 70.1,41.91 75.18,41.91 P3.29
PC5
  Top 0.254: MICRO1.45 62.92,49.86 69.6,43.18 P3.28
PC7
  Top 0.254: P2.12 40.64,74.42 46.28,68.78 MICRO1.97
PC11
  Top 0.254: MICRO1.112 37.2,61.86 26.67,72.39 23.88,72.39 P1.33
PD1
  Top 0.254: MICRO1.115 36.41,60.36 28.19,68.58 P1.30
PD3
  Top 0.254: MICRO1.117 35.89,59.36 29.21,66.04 P1.28
PD4
  Top 0.254: MICRO1.118 35.63,58.86 29.72,64.77 23.88,64.77 P1.27
PD7
  Top 0.254: MICRO1.123 34.32,56.36 32.26,58.42 P1.22
PD8
  Top 0.254: MICRO1.77 56.28,67.2 66.04,76.96 P2.32
PD9
  Top 0.254: MICRO1.78 55.78,67.46 64.77,76.45 64.77,80.26 P2.31
PD10
  Top 0.254: MICRO1.79 55.28,67.73 63.5,75.95 P2.30
PD12
  Top 0.254: MICRO1.81 54.28,68.25 60.96,74.93 P2.28
PD13
  Top 0.254: MICRO1.82 53.78,68.51 59.69,74.42 59.69,80.26 P2.27
PD14
  Top 0.254: MICRO1.85 52.28,69.3 55.88,72.9 P2.24
PD15
  Top 0.254: MICRO1.86 51.78,69.56 54.61,72.39 54.61,80.26 P2.23
PDR_ON
  Top 0.254: MICRO1.143 37.72,46.35 27.18,35.81 27.18,34.8 25.4,33.02 P1.2 24.45,33.02 23.18,34.29 21.59,34.29 20.95,34.92 20.95,35.56 20.64,35.88 19.79,35.88 R1.1
PE0
  Top 0.254: P1.4 25.4,35.56 37.21,47.37 38.92,47.37 MICRO1.141
PE1
  Top 0.254: MICRO1.142 37.46,46.86 26.42,35.81 26.42,34.8 25.91,34.29 23.88,34.29 P1.3
PE2
  Top 0.254: P4.36 27.94,30.48 40.77,43.31 40.77,44 MICRO1.1
PE3
  Top 0.254: P4.35 29.21,28.96 29.21,30.99 41.27,43.05 MICRO1.2
PE4
  Top 0.254: P4.34 30.48,31.5 41.78,42.8 MICRO1.3
PE7
  Top 0.254: MICRO1.58 64.49,56.36 67.82,59.69 75.18,59.69 P3.15
PE8
  Top 0.254: MICRO1.59 64.23,56.86 68.33,60.96 P3.14
PE9
  Top 0.254: MICRO1.60 63.96,57.36 68.83,62.23 75.18,62.23 P3.13
PE10
  Top 0.254: MICRO1.63 63.18,58.86 70.36,66.04 P3.10
PE11
  Top 0.254: MICRO1.64 62.92,59.36 70.87,67.31 75.18,67.31 P3.9
PE12
  Top 0.254: MICRO1.65 62.65,59.86 71.37,68.58 P3.8
PE13
  Top 0.254: MICRO1.66 62.39,60.36 71.88,69.85 75.18,69.85 P3.7
PE14
  Top 0.254: MICRO1.67 62.13,60.86 72.39,71.12 P3.6
PE15
  Top 0.254: MICRO1.68 61.87,61.36 72.9,72.39 75.18,72.39 P3.5
PF2
  Top 0.254: P4.25 41.91,28.96 41.91,36.07 46.28,40.44 MICRO1.12
PF11
  Top 0.254: MICRO1.49 63.96,51.86 67.56,48.26 P3.24
PF12
  Top 0.254: MICRO1.50 64.23,52.36 67.06,49.53 75.18,49.53 P3.23
PF13
  Top 0.254: MICRO1.53 65.01,53.86 65.53,53.34 P3.20
PF14
  Top 0.254: MICRO1.54 65.79,54.36 66.04,54.61 75.18,54.61 P3.19
PF15
  Top 0.254: MICRO1.55 65.53,54.86 66.55,55.88 P3.18
PG0
  Top 0.254: MICRO1.56 65.27,55.36 67.06,57.15 75.18,57.15 P3.17
PG1
  Top 0.254: MICRO1.57 64.75,55.86 67.31,58.42 P3.16
PG2
  Top 0.254: MICRO1.87 51.28,69.82 53.34,71.88 P2.22
PG3
  Top 0.254: MICRO1.88 50.78,70.08 52.07,71.37 52.07,80.26 P2.21
PG4
  Top 0.254: MICRO1.89 50.28,70.35 50.8,70.87 P2.20
PG5
  Top 0.254: MICRO1.90 49.78,70.62 49.53,70.87 49.53,80.26 P2.19
PG6
  Top 0.254: P2.18 48.26,71.37 49.28,70.36 MICRO1.91
PG7
  Top 0.254: P2.17 48.26,81.28 46.99,80.01 46.99,71.88 48.77,70.1 48.77,65.22 MICRO1.92
PG8
  Top 0.254: P2.16 45.72,72.39 48.26,69.85 48.26,65.23 MICRO1.93
PG10
  Top 0.254: MICRO1.125 33.79,55.36 33.27,55.88 P1.20
PG12
  Top 0.254: P1.18 32.51,53.34 33.53,54.36 MICRO1.127
PG13
  Top 0.254: MICRO1.128 33.79,53.86 32,52.07 23.88,52.07 P1.17
PG15
  Top 0.254: MICRO1.132 34.84,51.86 29.97,46.99 23.88,46.99 P1.13
PH0
  Top 0.254: MICRO1.23 51.78,39.91 55.88,35.81 P4.14 55.88,29.53 54.61,28.26 54.61,25.82 Q1.3
PH1
  Top 0.254: P4.13 57.15,28.96 57.15,35.31 52.32,40.13 52.32,43.97 MICRO1.24
REG_OR_USB
  Top 0.406: 3V3_REG.3 3.17,90.06 C21.1 5.49,92.81 D1.C 7.61,93.03 T1.2
SERVO1CURRENT
  Top 0.254: MICRO1.28 54.28,41.22 62.23,33.27 62.23,28.96 P4.9 60.96,20.32 60.64,20 42.23,20 41.27,19.05 41.27,8.22 BACKPLANECON_.S36
SERVO1PWM  (via drill 0.25)
  Top 0.254: MICRO1.4 42.29,42.55 31.75,32 31.75,28.96 P4.33 30.48,27.62 29.21,26.35 27.3,26.35 26.35,27.3 26.35,29.06 26.04,29.38 19.27,29.38 v19.1,29.21
  Bottom 0.254: v19.1,29.21 17.46,29.21 16.51,28.26 16.51,10.08 BACKPLANECON_.S20
SERVO2CURRENT
  Top 0.254: MICRO1.27 53.78,40.96 60.96,33.78 P4.10 60.64,29.91 60.64,29.21 59.69,28.26 59.69,20.95 59.37,20.64 39.05,20.64 38.73,20.32 38.73,9.12 37.45,7.2 BACKPLANECON_.S35
SERVO2PWM  (via drill 0.25)
  Top 0.254: v19.98,28.69 25.08,28.69 25.4,28.37 25.4,27.3 26.99,25.72 30.48,25.72 31.75,26.99 31.75,28.26 32.38,28.89 32.38,29.59 P4.32 33.02,32.51 42.8,42.29 42.8,43.99 MICRO1.5
  Bottom 0.254: v19.98,28.69 19.23,27.94 17.78,27.94 17.14,27.3 17.14,11.98 BACKPLANECON_.S21
SPI_LED_CLK  (via drill 0.25)
  Top 0.254: MICRO1.111 37.46,62.36 26.16,73.66 P1.34 | A6282.3 50.53,101.65 50.8,101.92 52.7,101.92 53.66,100.97 v53.66,97.47
  Bottom 0.254: v53.66,97.47 53.66,84.14 52.07,82.55 52.07,77.15 51.44,76.52 28.26,76.52 27.62,75.88 27.62,74.3 26.99,73.66 P1.34
SPI_LED_MOSI  (via drill 0.25)
  Top 0.254: P1.10 28.45,43.18 35.64,50.37 38.82,50.37 MICRO1.135 | A6282.2 51.19,101.03 51.44,101.28 52.39,101.28 52.97,100.7 52.97,96.57 v54.61,94.93
  Bottom 0.254: v54.61,94.93 54.61,76.83 53.66,75.88 30.48,75.88 28.89,74.3 28.89,45.09 26.99,43.18 P1.10
STEP1
  Top 0.254: MICRO1.76 56.78,66.94 67.31,77.47 67.31,80.26 P2.33
  Bottom 0.254: BACKPLANECON_.S33 33.66,8.22 33.66,14.92 31.11,17.46 31.11,22.54 30.48,23.18 26.04,23.18 23.5,25.72 23.5,30.8 24.13,31.43 25.4,31.43 29.84,35.88 68.26,35.88 68.58,36.2 68.58,76.52 67.31,77.79 67.31,80.26 P2.33
STEP2
  Top 0.254: MICRO1.75 57.28,66.68 68.58,77.98 P2.34
  Bottom 0.254: BACKPLANECON_.S43 37.47,9.49 37.47,16.19 37.15,16.51 33.02,16.51 31.75,17.78 31.75,23.18 31.11,23.81 26.35,23.81 24.32,25.84 24.32,30.4 24.71,30.8 25.4,30.8 29.84,35.24 68.9,35.24 69.22,35.56 69.22,78.36 P2.34 68.58,77.98
STEPDIR1  (via drill 0.25)
  Top 0.254: P4.28 38.1,34.54 44.78,41.22 44.78,43.91 MICRO1.9 | v39.69,19.93 39.69,9.78 BACKPLANECON_.S44
  Bottom 0.254: P4.28 38.1,29.53 36.83,28.26 36.83,22.78 v39.69,19.93
STEPDIR2  (via drill 0.25)
  Top 0.254: P4.29 36.83,28.96 36.83,34.04 44.32,41.53 44.32,43.97 MICRO1.8 | BACKPLANECON_.S42 34.92,9.78 v34.92,19.05
  Bottom 0.254: P4.29 35.56,19.68 v34.92,19.05
STEPEN  (via drill 0.25)
  Top 0.254: P4.30 35.56,33.53 43.81,41.78 43.81,43.98 MICRO1.7 | BACKPLANECON_.S34 34.91,7.29 36.2,8.57 36.2,18.78 34.53,20.45 v34.53,20.95
  Bottom 0.254: P4.30 34.53,29.2 v34.53,20.95
SWCLK
  Top 0.254: MICRO1.109 37.99,63.36 P1.36 23.88,77.47 6.03,77.47 5.4,76.83 JP4.2
SWDIO  (via drill 0.25)
  Top 0.254: P2.4 30.48,78.49 42.29,66.67 42.29,65.2 MICRO1.105 | v23.5,80.33 v20.95,80.33
  Bottom 0.254: v23.5,80.33 29.21,80.33 29.21,80.26 P2.4 | v20.95,80.33 19.37,78.74 19.37,73.34 17.78,71.75 JP4.4
SWO  (via drill 0.25)
  Top 0.254: P1.12 29.46,45.72 35.1,51.36 MICRO1.133 | v13.28,47.36 13.28,64.5 11.11,66.67 JP4.6
  Bottom 0.254: P1.12 24.77,45.72 23.5,46.99 13.65,46.99 v13.28,47.36
TETHER_RX  (via drill 0.25)
  Top 0.254: MICRO1.129 34.06,53.36 31.5,50.8 P1.16 24.45,50.8 23.18,52.07 18.41,52.07 17.7,51.36 17.7,27.04 19.29,25.45 v19.68,25.45
  Bottom 0.254: BACKPLANECON_.S46 43.81,8.22 43.81,2.54 43.18,1.91 29.84,1.91 29.21,2.54 29.21,20.95 28.89,21.27 25.08,21.27 20.9,25.45 v19.68,25.45
TETHER_TX  (via drill 0.25)
  Top 0.254: MICRO1.124 38.91,55.88 33.97,55.88 32.7,57.15 24.13,57.15 22.86,58.42 P1.21 21.27,58.42 18.41,56.2 v18.41,52.78 | v18.41,51.09 18.41,27.3 19.56,26.16 v20.64,26.16
  Bottom 0.254: BACKPLANECON_.S45 41.27,8.22 41.27,3.17 40.64,2.54 30.48,2.54 29.84,3.17 29.84,21.27 29.21,21.91 25.4,21.91 21.14,26.16 v20.64,26.16 | v18.41,52.78 v18.41,51.09
TURNCURRENT
  Top 0.254: MICRO1.29 54.78,41.49 63.5,32.77 P4.8 62.87,29.59 62.87,28.89 62.23,28.26 62.23,20 61.59,19.37 44.23,19.37 43.6,18.73 43.6,8.99 42.53,7.92 BACKPLANECON_.S37
TURNPWM1
  Top 0.254: P3.31 75.18,39.37 71.12,39.37 62.13,48.36 MICRO1.42
  Bottom 0.203: BACKPLANECON_.S39 46.55,8.01 46.55,17.46 46.23,17.78 33.66,17.78 33.02,18.41 33.02,24.45 32.38,25.08 26.99,25.08 26.35,25.72 26.35,28.26 26.99,28.89 28.57,28.89 29.21,29.53 29.21,32.7 29.84,33.34 70.48,33.34 71.12,33.97 71.12,39.05 71.44,39.37 75.18,39.37 P3.31
TURNPWM2
  Top 0.254: P3.30 70.61,40.64 62.39,48.86 MICRO1.43
  Bottom 0.203: BACKPLANECON_.S38 46.14,8.01 46.14,16.51 45.5,17.14 33.34,17.14 32.38,18.1 32.38,23.81 31.75,24.45 26.67,24.45 25.4,25.72 25.4,29.53 29.84,33.97 70.17,33.97 70.48,34.29 70.48,39.56 71.56,40.64 P3.30
USB_D+  (via drill 0.25)
  Top 0.254: MICRO1.104 42.8,65.23 42.8,66.93 31.75,77.98 31.75,80.26 P2.5 33.02,81.92 33.66,82.55 33.66,84.45 33.02,85.09 28.89,85.09 27.94,86.04 27.94,94.61 26.96,95.59 v11.72,95.59 | RN1.3 6.03,101.29 v6.03,99.06
  Bottom 0.254: v11.72,95.59 8.57,98.74 6.67,98.74 6.35,99.06 v6.03,99.06
USB_D-  (via drill 0.25)
  Top 0.254: MICRO1.103 43.31,65.24 43.31,67.18 33.02,77.47 P2.6 33.02,79.69 34.29,80.96 34.29,84.77 33.34,85.72 29.21,85.72 28.57,86.36 28.57,95.25 27.55,96.28 v12.94,96.28 | RN1.4 6.99,101.44 v6.99,99.69
  Bottom 0.254: v12.94,96.28 9.53,99.69 v6.99,99.69
V_CAP_1  (via drill 0.51)
  Top 0.254: P3.2 73.41,76.2 72.14,74.93 72.14,73.91 61.09,62.87 MICRO1.71 | MICRO1.71 | MICRO1.71 59.05,62.87 v58.42,62.23
  Bottom 0.254: v58.42,62.23 59.73,62.23 C13.1
V_CAP_2  (via drill 0.51)
  Top 0.254: P2.3 29.21,80.26 29.21,78.49 29.97,77.72 30.48,77.72 41.78,66.55 41.78,65.33 MICRO1.106 41.78,64.27 42.55,63.5 v42.86,63.5
  Bottom 0.254: v42.86,63.5 C17.1
VSEL1
  Top 0.254: P4.27 39.37,28.96 39.37,35.05 45.29,40.97 45.29,43.9 MICRO1.10
  Bottom 0.254: BACKPLANECON_.S47 48.26,10.13 48.26,20.64 47.62,21.27 39.69,21.27 38.73,22.23 38.73,26.35 38.1,26.99 P4.27
VSEL2
  Top 0.254: P4.26 40.64,35.56 45.77,40.69 MICRO1.11
  Bottom 0.254: BACKPLANECON_.S48 50.16,17.4 50.16,20.95 49.21,21.91 46.04,21.91 45.09,22.86 40.01,22.86 39.37,23.5 39.37,28.26 40.64,29.53 P4.26
VSEN1
  Top 0.254: MICRO1.15 47.75,43.98 47.75,39.62 45.72,37.59 P4.22 45.72,29.53 44.45,28.26 44.45,23.18 43.81,22.54 32.07,22.54 31.75,22.23 31.75,11.11 31.11,10.48 31.11,5.08 30.48,4.45 27.32,4.45 BACKPLANECON_.S8
VSEN2
  Top 0.203: BACKPLANECON_.S7 25.8,5.47 29.84,5.47 30.48,6.11 30.48,10.48 31.11,11.11 31.11,22.86 31.43,23.18 42.55,23.18 43.18,23.81 P4.23
  Top 0.254: P4.23 44.45,28.96 44.45,37.08 47.24,39.88 47.24,43.97 MICRO1.14
VSEN3
  Top 0.203: BACKPLANECON_.S6 23.67,5.88 29.4,5.88 29.84,6.33 29.84,10.48 30.48,11.11 30.48,23.5 30.8,23.81 41.27,23.81 41.91,24.45 41.91,28.26 43.18,29.53 P4.24
  Top 0.254: P4.24 43.18,36.58 46.76,40.16 46.76,43.99 MICRO1.13
VUSB  (via drill 0.25)
  Top 0.254: P2.8 35.56,76.45 44.32,67.69 44.32,65.17 MICRO1.101 | v28.26,84.45 27.3,85.41 27.3,93.98 26.39,94.89 T1.1
  Top 0.406: JP1.P1 7.62,103.19 10.54,100.27 T1.1
  Bottom 0.254: P2.8 34.29,80.26 34.29,82.23 32.38,84.14 28.57,84.14 v28.26,84.45

## Text on the board
Document: NRST | BOOT0 | IMU_BOOT | IMU_RST | USB | 1 | Micro Board / Purdue IEEE ROV 2015 / Designed by Nick Molo | SWD Header | OLED Disp